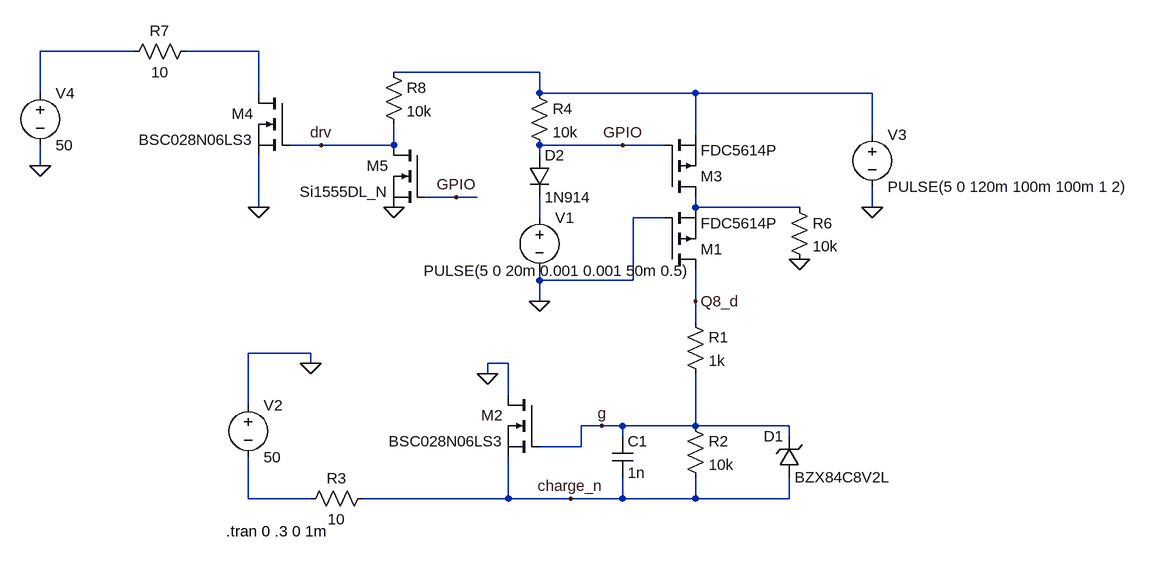
[diagram p0: schematic ebike-fet.asc]
ebike-fet.asc, the LTspice schematic file:
Version 4
SHEET 1 956 692
WIRE -624 -144 -768 -144
WIRE -432 -144 -544 -144
WIRE 0 -112 -224 -112
WIRE -768 -80 -768 -144
WIRE -432 -80 -432 -144
WIRE 0 -80 0 -112
WIRE 240 -80 0 -80
WIRE 512 -80 240 -80
WIRE 240 -16 240 -80
WIRE 512 -16 512 -80
WIRE -336 0 -384 0
WIRE -224 0 -224 -32
WIRE -224 0 -336 0
WIRE 128 0 0 0
WIRE 192 0 128 0
WIRE 0 16 0 0
WIRE -768 32 -768 0
WIRE -128 80 -176 80
WIRE -96 80 -128 80
WIRE -432 96 -432 16
WIRE 240 96 240 80
WIRE 400 96 240 96
WIRE 512 96 512 64
WIRE 0 112 0 80
WIRE 192 112 144 112
WIRE 0 208 0 192
WIRE 144 208 144 112
WIRE 144 208 0 208
WIRE 0 240 0 208
WIRE 240 240 240 192
WIRE 240 272 240 240
WIRE -352 320 -448 320
WIRE -352 336 -352 320
WIRE -48 336 -80 336
WIRE -80 352 -80 336
WIRE -48 384 -48 336
WIRE -448 400 -448 320
WIRE 96 432 64 432
WIRE 128 432 96 432
WIRE 240 432 240 352
WIRE 240 432 128 432
WIRE 384 432 240 432
WIRE 128 448 128 432
WIRE 384 448 384 432
WIRE 64 464 64 432
WIRE 64 464 0 464
WIRE -448 544 -448 480
WIRE -352 544 -448 544
WIRE -48 544 -48 480
WIRE -48 544 -272 544
WIRE 48 544 -48 544
WIRE 128 544 128 512
WIRE 128 544 48 544
WIRE 240 544 240 512
WIRE 240 544 128 544
WIRE 384 544 384 512
WIRE 384 544 240 544
FLAG -80 352 0
FLAG 0 240 0
FLAG -352 336 0
FLAG 48 544 charge_n
FLAG 96 432 g
FLAG 240 240 Q8_d
FLAG 512 96 0
FLAG -432 96 0
FLAG -768 32 0
FLAG -336 0 drv
FLAG 128 0 GPIO
FLAG -224 96 0
FLAG 400 176 0
FLAG -128 80 GPIO
SYMBOL pmos 192 192 M180
SYMATTR InstName M1
SYMATTR Value FDC5614P
SYMBOL res 224 256 R0
SYMATTR InstName R1
SYMATTR Value 1k
SYMBOL res 224 416 R0
SYMATTR InstName R2
SYMATTR Value 10k
SYMBOL zener 400 512 R180
WINDOW 0 24 64 Left 2
WINDOW 3 -140 1 Left 2
SYMATTR InstName D1
SYMATTR Value BZX84C8V2L
SYMATTR Description Diode
SYMATTR Type diode
SYMBOL cap 112 448 R0
SYMATTR InstName C1
SYMATTR Value 1n
SYMBOL voltage 0 96 R0
WINDOW 3 -178 97 Left 2
WINDOW 123 0 0 Left 0
WINDOW 39 0 0 Left 0
SYMATTR InstName V1
SYMATTR Value PULSE(5 0 20m 0.001 0.001 50m 0.5)
SYMBOL nmos 0 384 M0
SYMATTR InstName M2
SYMATTR Value BSC028N06LS3
SYMBOL res -256 528 R90
WINDOW 0 0 56 VBottom 2
WINDOW 3 32 56 VTop 2
SYMATTR InstName R3
SYMATTR Value 10
SYMBOL voltage -448 384 R0
WINDOW 123 0 0 Left 0
WINDOW 39 0 0 Left 0
SYMATTR InstName V2
SYMATTR Value 50
SYMBOL pmos 192 80 M180
SYMATTR InstName M3
SYMATTR Value FDC5614P
SYMBOL voltage 512 -32 R0
WINDOW 123 0 0 Left 0
WINDOW 39 0 0 Left 0
SYMATTR InstName V3
SYMATTR Value PULSE(5 0 120m 100m 100m 1 2)
SYMBOL diode -16 16 R0
SYMATTR InstName D2
SYMATTR Value 1N914
SYMBOL res -16 -96 R0
SYMATTR InstName R4
SYMATTR Value 10k
SYMBOL nmos -384 -80 M0
SYMATTR InstName M4
SYMATTR Value BSC028N06LS3
SYMBOL res 384 80 R0
SYMATTR InstName R6
SYMATTR Value 10k
SYMBOL voltage -768 -96 R0
WINDOW 123 0 0 Left 0
WINDOW 39 0 0 Left 0
SYMATTR InstName V4
SYMATTR Value 50
SYMBOL res -528 -160 R90
WINDOW 0 0 56 VBottom 2
WINDOW 3 32 56 VTop 2
SYMATTR InstName R7
SYMATTR Value 10
SYMBOL nmos -176 0 M0
SYMATTR InstName M5
SYMATTR Value Si1555DL_N
SYMBOL res -240 -128 R0
SYMATTR InstName R8
SYMATTR Value 10k
TEXT -482 594 Left 2 !.tran 0 .3 0 1m

The netlist it stands for:
* ebike-fet.asc
M1 Q8_d 0 N004 N004 FDC5614P
R1 Q8_d g 1k
R2 g charge_n 10k
D1 charge_n g BZX84C8V2L
C1 g charge_n 1n
V1 N005 0 PULSE(5 0 20m 0.001 0.001 50m 0.5)
M2 0 g charge_n charge_n BSC028N06LS3
R3 charge_n N006 10
V2 0 N006 50
M3 N004 GPIO N003 N003 FDC5614P
V3 N003 0 PULSE(5 0 120m 100m 100m 1 2)
D2 GPIO N005 1N914
R4 N003 GPIO 10k
M4 N002 drv 0 0 BSC028N06LS3
R6 N004 0 10k
V4 N001 0 50
R7 N002 N001 10
M5 drv GPIO 0 0 Si1555DL_N
R8 N003 drv 10k
.model D D
.lib standard.dio
.model NMOS NMOS
.model PMOS PMOS
.lib standard.mos
.tran 0 .3 0 1m
.backanno
.end